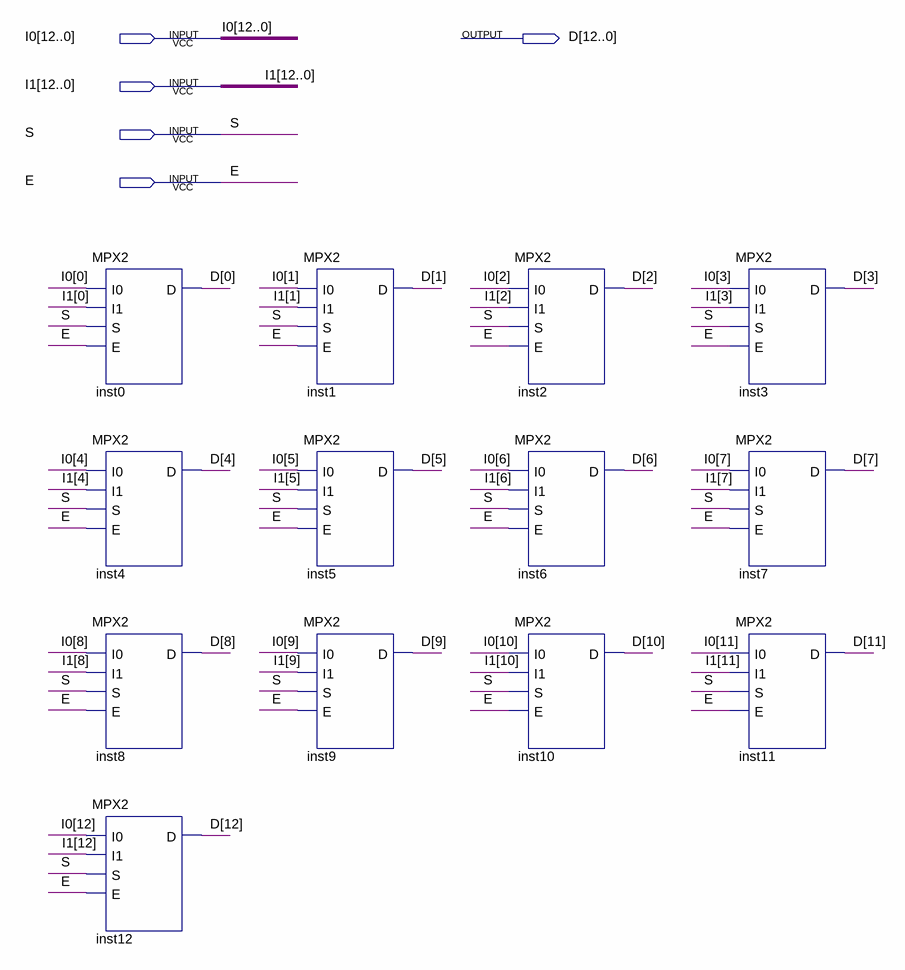
[diagram p0: schematic sheet]
// Quartus schematic MPX2_13BIT.bdf as structural Verilog: 13 symbols, 5 pins
module MPX2_13BIT (
  input  [12:0] I0,
  input  [12:0] I1,
  input  S,
  input  E,
  output [12:0] D
);

  MPX2 inst0 (.I0(I0[0]), .I1(I1[0]), .S(S), .E(E), .D(D[0]));
  MPX2 inst4 (.I0(I0[4]), .I1(I1[4]), .S(S), .E(E), .D(D[4]));
  MPX2 inst8 (.I0(I0[8]), .I1(I1[8]), .S(S), .E(E), .D(D[8]));
  MPX2 inst12 (.I0(I0[12]), .I1(I1[12]), .S(S), .E(E), .D(D[12]));
  MPX2 inst1 (.I0(I0[1]), .I1(I1[1]), .S(S), .E(E), .D(D[1]));
  MPX2 inst5 (.I0(I0[5]), .I1(I1[5]), .S(S), .E(E), .D(D[5]));
  MPX2 inst9 (.I0(I0[9]), .I1(I1[9]), .S(S), .E(E), .D(D[9]));
  MPX2 inst2 (.I0(I0[2]), .I1(I1[2]), .S(S), .E(E), .D(D[2]));
  MPX2 inst6 (.I0(I0[6]), .I1(I1[6]), .S(S), .E(E), .D(D[6]));
  MPX2 inst10 (.I0(I0[10]), .I1(I1[10]), .S(S), .E(E), .D(D[10]));
  MPX2 inst3 (.I0(I0[3]), .I1(I1[3]), .S(S), .E(E), .D(D[3]));
  MPX2 inst7 (.I0(I0[7]), .I1(I1[7]), .S(S), .E(E), .D(D[7]));
  MPX2 inst11 (.I0(I0[11]), .I1(I1[11]), .S(S), .E(E), .D(D[11]));
endmodule
